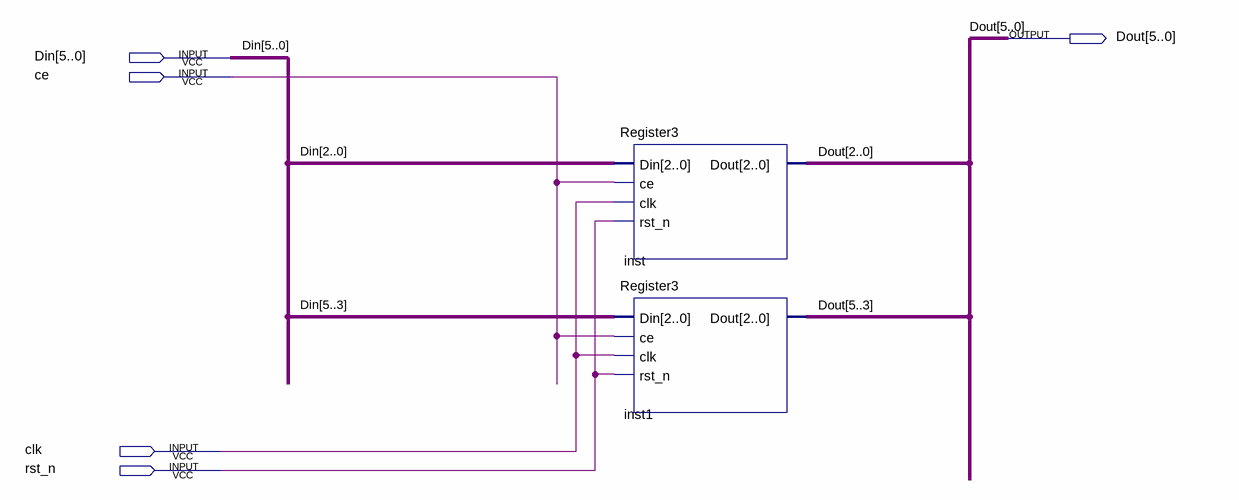
[diagram p0: schematic sheet]
// Quartus schematic Register6.bdf as structural Verilog: 2 symbols, 5 pins
module Register6 (
  input  [5:0] Din,
  input  ce,
  input  clk,
  input  rst_n,
  output [5:0] Dout
);

  Register3 inst (.Din(Din[2:0]), .ce(ce), .clk(clk), .rst_n(rst_n), .Dout(Dout[2:0]));
  Register3 inst1 (.Din(Din[5:3]), .ce(ce), .clk(clk), .rst_n(rst_n), .Dout(Dout[5:3]));
endmodule
